# Altium schematic sheet orbital-r1.SchDoc
size 400 x 299 mm; SheetNumber: 1; SheetTotal: 1
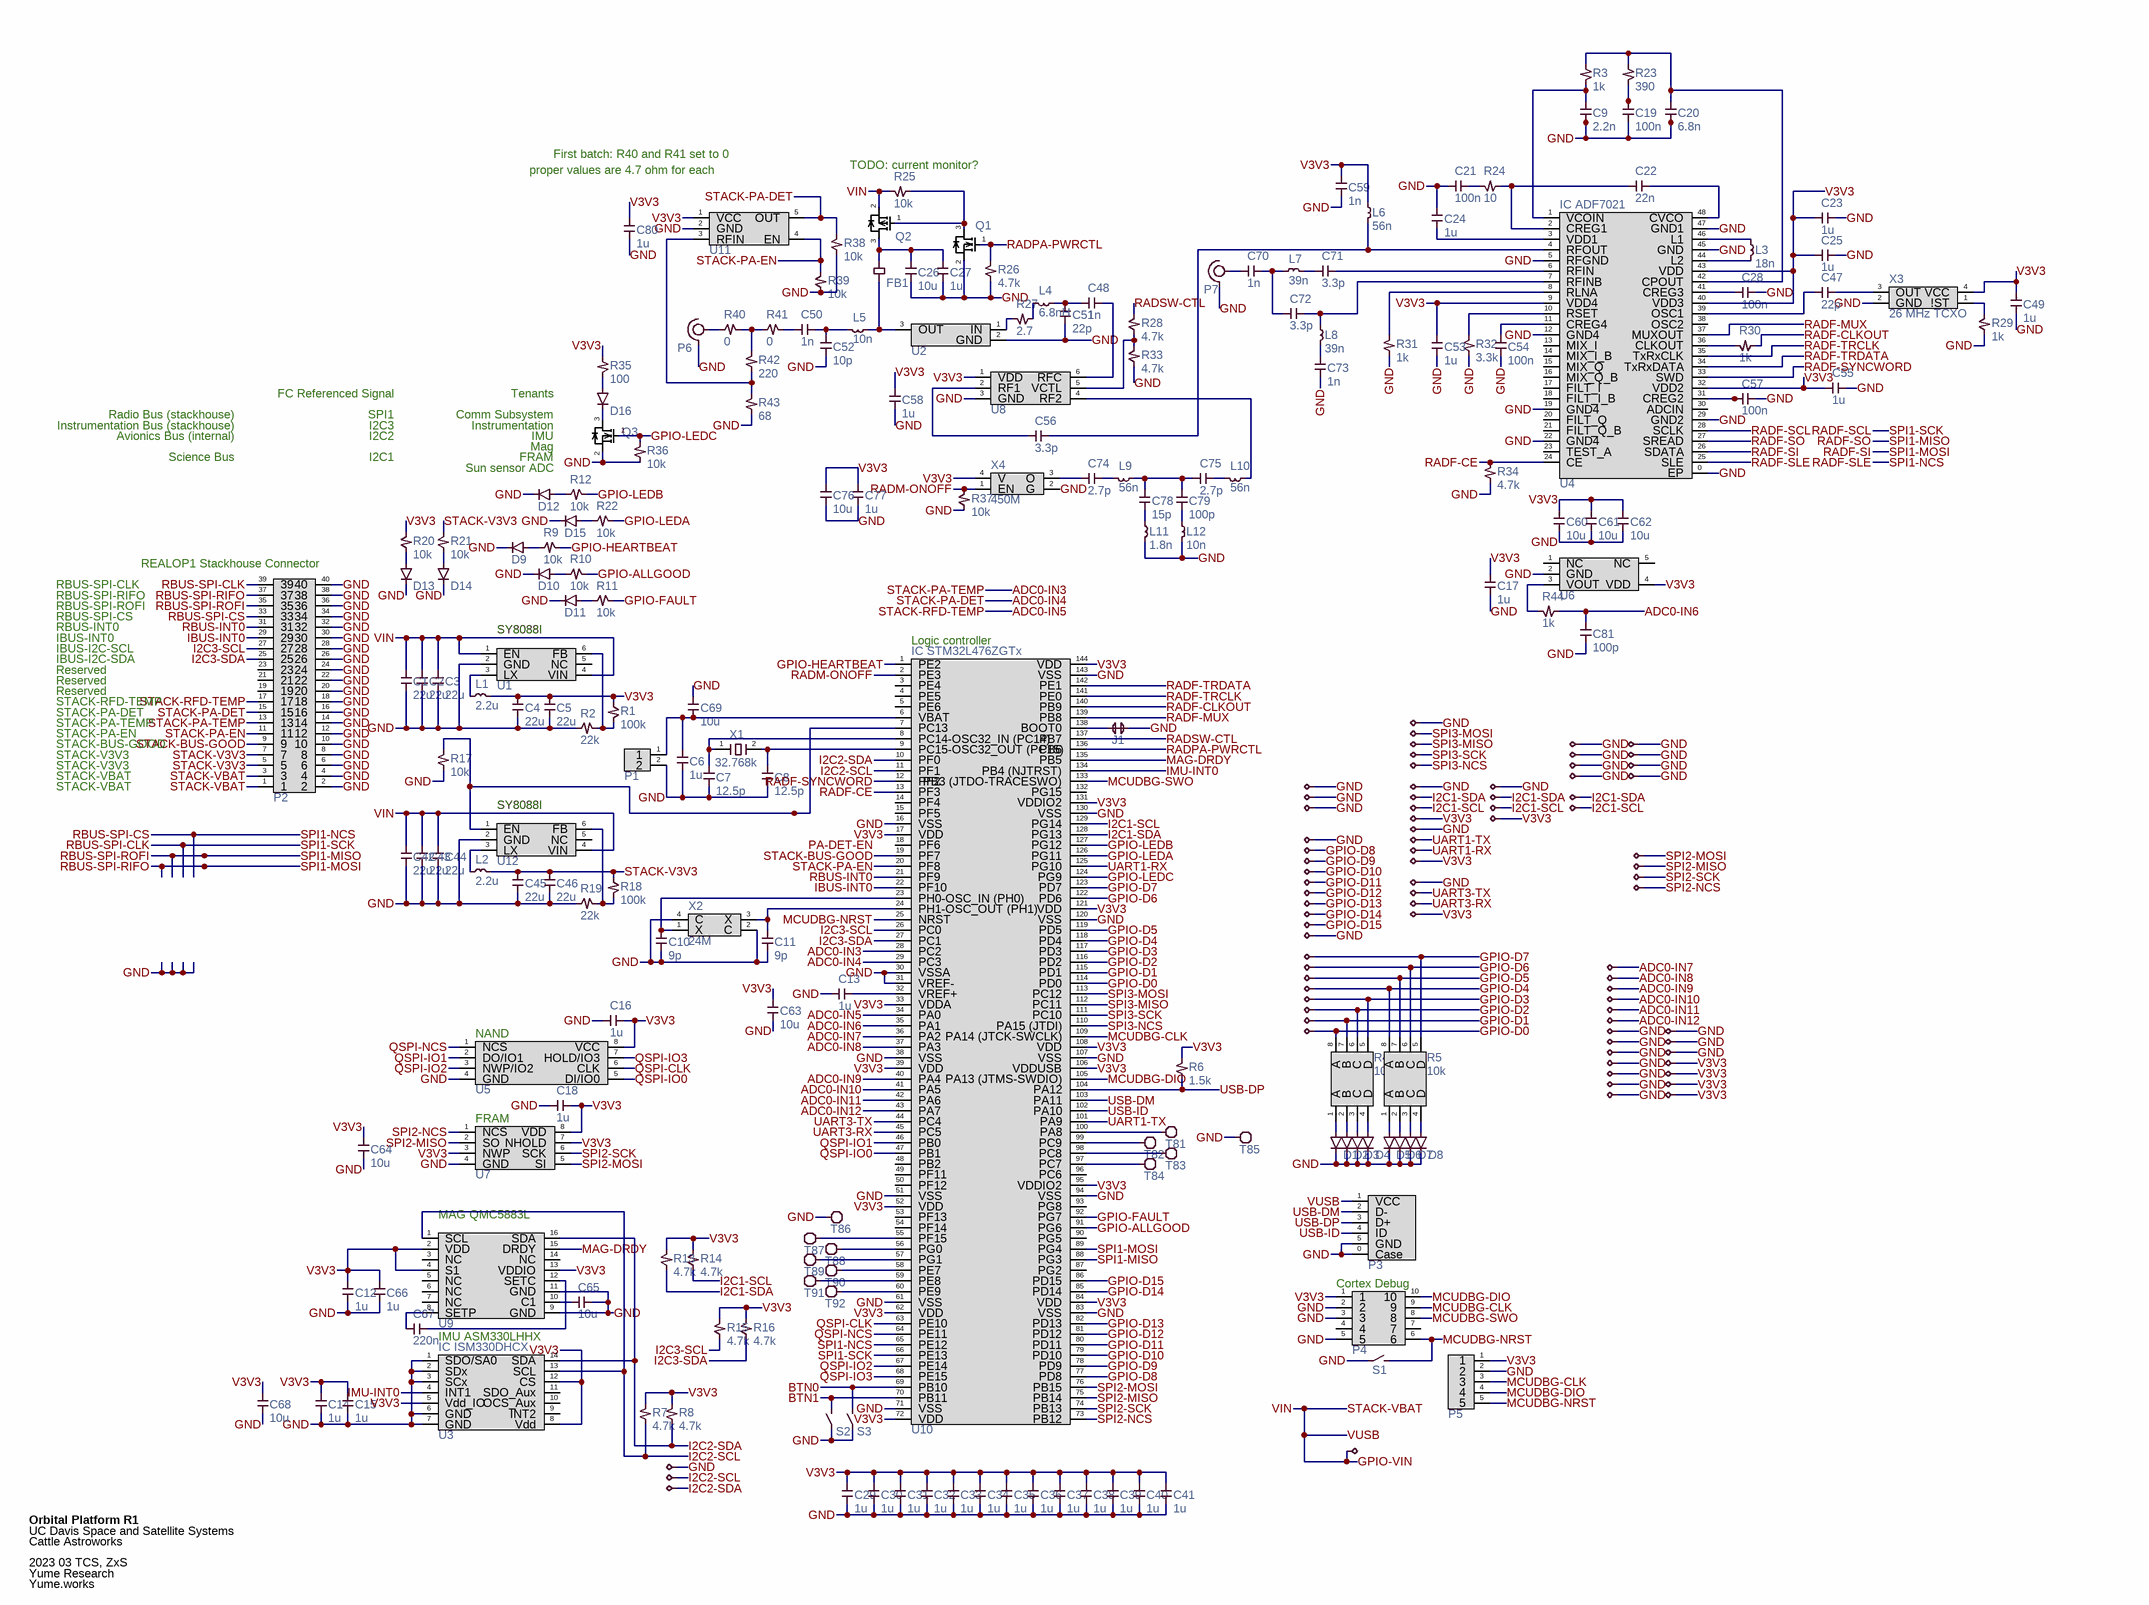
[diagram p0: orbital-r1.SchDoc]

## Parts
C1  22u  [C0805]
C2  22u  [C0805]
C3  22u  [C0805]
C4  22u  [C0805]
C5  22u  [C0805]
C6  1u  [C0402]
C7  12.5p  [C0402]
C8  12.5p  [C0402]
C9  2.2n  [C0402]
C10  9p  [C0402]
C11  9p  [C0402]
C12  1u  [C0402]
C13  1u  [C0402]
C14  1u  [C0402]
C15  1u  [C0402]
C16  1u  [C0402]
C17  1u  [C0402]
C18  1u  [C0402]
C19  100n  [C0402]
C20  6.8n  [C0402]
C21  100n  [C0402]
C22  22n  [C0402]
C23  1u  [C0402]
C24  1u  [C0402]
C25  1u  [C0402]
C26  10u  [C0603]
C27  1u  [C0402]
C28  100n  [C0402]
C29  1u  [C0402]
C30  1u  [C0402]
C31  1u  [C0402]
C32  1u  [C0402]
C33  1u  [C0402]
C34  1u  [C0402]
C35  1u  [C0402]
C36  1u  [C0402]
C37  1u  [C0402]
C38  1u  [C0402]
C39  1u  [C0402]
C40  1u  [C0402]
C41  1u  [C0402]
C42  22u  [C0805]
C43  22u  [C0805]
C44  22u  [C0805]
C45  22u  [C0805]
C46  22u  [C0805]
C47  22p  [C0402]
C48  1n  [C0402]
C49  1u  [C0402]
C50  1n  [C0402]
C51  22p  [C0402]
C52  10p  [C0402]
C53  1u  [C0402]
C54  100n  [C0402]
C55  1u  [C0402]
C56  3.3p  [C0402]
C57  100n  [C0402]
C58  1u  [C0402]
C59  1n  [C0402]
C60  10u  [C0603]
C61  10u  [C0603]
C62  10u  [C0603]
C63  10u  [C0603]
C64  10u  [C0603]
C65  10u  [C0603]
C66  1u  [C0402]
C67  220n  [C0402]
C68  10u  [C0603]
C69  10u  [C0603]
C70  1n  [C0402]
C71  3.3p  [C0402]
C72  3.3p  [C0402]
C73  1n  [C0402]
C74  2.7p  [C0402]
C75  2.7p  [C0402]
C76  10u  [C0603]
C77  1u  [C0402]
C78  15p  [C0402]
C79  100p  [C0402]
C80  1u  [C0402]
C81  100p  [C0402]
D1  LED White  [LED0603v2]  (value not drawn)
D2  LED White  [LED0603v2]  (value not drawn)
D3  LED White  [LED0603v2]  (value not drawn)
D4  LED White  [LED0603v2]  (value not drawn)
D5  LED White  [LED0603v2]  (value not drawn)
D6  LED White  [LED0603v2]  (value not drawn)
D7  LED White  [LED0603v2]  (value not drawn)
D8  LED White  [LED0603v2]  (value not drawn)
D9  LED Yellow  [LED0603v2]  (value not drawn)
D10  LED Green  [LED0603v2]  (value not drawn)
D11  LED Red  [LED0603v2]  (value not drawn)
D12  LED Blue  [LED0603v2]  (value not drawn)
D13  LED Yellow  [LED0603v2]  (value not drawn)
D14  LED Yellow  [LED0603v2]  (value not drawn)
D15  LED Blue  [LED0603v2]  (value not drawn)
D16  D VLMx333  [PLCC2]  (value not drawn)
FB1  FB0603  [C0603]  (value not drawn)
J1  J-16M  [J16M]  (value not drawn)  (net tie, no BOM)
L1  2.2u  [C1008]
L2  2.2u  [C1008]
L3  18n  [C0402]
L4  6.8nH  [C0402]
L5  10n  [C0402]
L6  56n  [C0402]
L7  39n  [C0402]
L8  39n  [C0402]
L9  56n  [C0402]
L10  56n  [C0402]
L11  1.8n  [C0402]
L12  10n  [C0402]
P1  H254-021-85  [H254-021-85]  (value not drawn)
P2  H254-202-85  [H254-202-85]  (value not drawn)
P3  P Micro USB B  [USB-Micro-B]  (value not drawn)
P4  H127-052-S  [H127-052-S]  (value not drawn)
P5  H254-051-85  [H254-051-85]  (value not drawn)
P6  P MMCX-EM  [MMCX-EM]  (value not drawn)
P7  P MMCX-EM  [MMCX-EM]  (value not drawn)
Q1  Q NCE3400  [SOT23-3]  (value not drawn)
Q2  Q Si2301  [SOT23-3]  (value not drawn)
Q3  Q NCE3400  [SOT23-3]  (value not drawn)
R1  100k  [C0402]
R2  22k  [C0402]
R3  1k  [C0402]
R4  10k  [R0603x4]
R5  10k  [R0603x4]
R6  1.5k  [C0402]
R7  4.7k  [C0402]
R8  4.7k  [C0402]
R9  10k  [C0402]
R10  10k  [C0402]
R11  10k  [C0402]
R12  10k  [C0402]
R13  4.7k  [C0402]
R14  4.7k  [C0402]
R15  4.7k  [C0402]
R16  4.7k  [C0402]
R17  10k  [C0402]
R18  100k  [C0402]
R19  22k  [C0402]
R20  10k  [C0402]
R21  10k  [C0402]
R22  10k  [C0402]
R23  390  [C0402]
R24  10  [C0402]
R25  10k  [C0402]
R26  4.7k  [C0402]
R27  2.7  [C0402]
R28  4.7k  [C0402]
R29  1k  [C0402]
R30  1k  [C0402]
R31  1k  [C0402]
R32  3.3k  [C0402]
R33  4.7k  [C0402]
R34  4.7k  [C0402]
R35  100  [C0603]
R36  10k  [C0402]
R37  10k  [C0402]
R38  10k  [C0402]
R39  10k  [C0402]
R40  0  [C0402]
R41  0  [C0402]
R42  220  [C0402]
R43  68  [C0402]
R44  1k  [C0402]
S1  S BTN1185  [BTN1185]  (value not drawn)
S2  S BTN1185  [BTN1185]  (value not drawn)
S3  S BTN1185  [BTN1185]  (value not drawn)
T1  TP254-2  [H254-011-85]  (value not drawn)
T2  TP254-2  [H254-011-85]  (value not drawn)
T3  TP254-2  [H254-011-85]  (value not drawn)
T4  TP254-2  [H254-011-85]  (value not drawn)
T5  TP254-2  [H254-011-85]  (value not drawn)
T6  TP254-2  [H254-011-85]  (value not drawn)
T7  TP254-2  [H254-011-85]  (value not drawn)
T8  TP254-2  [H254-011-85]  (value not drawn)
T9  TP254-2  [H254-011-85]  (value not drawn)
T10  TP254-2  [H254-011-85]  (value not drawn)
T11  TP254-2  [H254-011-85]  (value not drawn)
T12  TP254-2  [H254-011-85]  (value not drawn)
T13  TP254-2  [H254-011-85]  (value not drawn)
T14  TP254-2  [H254-011-85]  (value not drawn)
T15  TP254-2  [H254-011-85]  (value not drawn)
T16  TP254-2  [H254-011-85]  (value not drawn)
T17  TP254-2  [H254-011-85]  (value not drawn)
T18  TP254-2  [H254-011-85]  (value not drawn)
T19  TP254-2  [H254-011-85]  (value not drawn)
T20  TP254-2  [H254-011-85]  (value not drawn)
T21  TP254-2  [H254-011-85]  (value not drawn)
T22  TP254-2  [H254-011-85]  (value not drawn)
T23  TP254-2  [H254-011-85]  (value not drawn)
T24  TP254-2  [H254-011-85]  (value not drawn)
T25  TP254-2  [H254-011-85]  (value not drawn)
T26  TP254-2  [H254-011-85]  (value not drawn)
T27  TP254-2  [H254-011-85]  (value not drawn)
T28  TP254-2  [H254-011-85]  (value not drawn)
T29  TP254-2  [H254-011-85]  (value not drawn)
T30  TP254-2  [H254-011-85]  (value not drawn)
T31  TP254-2  [H254-011-85]  (value not drawn)
T32  TP254-2  [H254-011-85]  (value not drawn)
T33  TP254-2  [H254-011-85]  (value not drawn)
T34  TP254-2  [H254-011-85]  (value not drawn)
T35  TP254-2  [H254-011-85]  (value not drawn)
T36  TP254-2  [H254-011-85]  (value not drawn)
T37  TP254-2  [H254-011-85]  (value not drawn)
T38  TP254-2  [H254-011-85]  (value not drawn)
T39  TP254-2  [H254-011-85]  (value not drawn)
T40  TP254-2  [H254-011-85]  (value not drawn)
T41  TP254-2  [H254-011-85]  (value not drawn)
T42  TP254-2  [H254-011-85]  (value not drawn)
T43  TP254-2  [H254-011-85]  (value not drawn)
T44  TP254-2  [H254-011-85]  (value not drawn)
T45  TP254-2  [H254-011-85]  (value not drawn)
T46  TP254-2  [H254-011-85]  (value not drawn)
T47  TP254-2  [H254-011-85]  (value not drawn)
T48  TP254-2  [H254-011-85]  (value not drawn)
T49  TP254-2  [H254-011-85]  (value not drawn)
T50  TP254-2  [H254-011-85]  (value not drawn)
T51  TP254-2  [H254-011-85]  (value not drawn)
T52  TP254-2  [H254-011-85]  (value not drawn)
T53  TP254-2  [H254-011-85]  (value not drawn)
T54  TP254-2  [H254-011-85]  (value not drawn)
T55  TP254-2  [H254-011-85]  (value not drawn)
T56  TP254-2  [H254-011-85]  (value not drawn)
T57  TP254-2  [H254-011-85]  (value not drawn)
T58  TP254-2  [H254-011-85]  (value not drawn)
T59  TP254-2  [H254-011-85]  (value not drawn)
T60  TP254-2  [H254-011-85]  (value not drawn)
T61  TP254-2  [H254-011-85]  (value not drawn)
T62  TP254-2  [H254-011-85]  (value not drawn)
T63  TP254-2  [H254-011-85]  (value not drawn)
T64  TP254-2  [H254-011-85]  (value not drawn)
T65  TP254-2  [H254-011-85]  (value not drawn)
T66  TP254-2  [H254-011-85]  (value not drawn)
T67  TP254-2  [H254-011-85]  (value not drawn)
T68  TP254-2  [H254-011-85]  (value not drawn)
T69  TP254-2  [H254-011-85]  (value not drawn)
T70  TP254-2  [H254-011-85]  (value not drawn)
T71  TP254-2  [H254-011-85]  (value not drawn)
T72  TP254-2  [H254-011-85]  (value not drawn)
T73  TP254-2  [H254-011-85]  (value not drawn)
T74  TP254-2  [H254-011-85]  (value not drawn)
T75  TP254-2  [H254-011-85]  (value not drawn)
T76  TP254-2  [H254-011-85]  (value not drawn)
T77  TP254-2  [H254-011-85]  (value not drawn)
T78  TP254-2  [H254-011-85]  (value not drawn)
T79  TP254-2  [H254-011-85]  (value not drawn)
T80  TP254-2  [H254-011-85]  (value not drawn)
T81  TP2510  [TP2510]  (value not drawn)  (no BOM)
T82  TP2510  [TP2510]  (value not drawn)  (no BOM)
T83  TP2510  [TP2510]  (value not drawn)  (no BOM)
T84  TP2510  [TP2510]  (value not drawn)  (no BOM)
T85  TP2510  [TP2510]  (value not drawn)  (no BOM)
T86  TP2510  [TP2510]  (value not drawn)  (no BOM)
T87  TP2510  [TP2510]  (value not drawn)  (no BOM)
T88  TP2510  [TP2510]  (value not drawn)  (no BOM)
T89  TP2510  [TP2510]  (value not drawn)  (no BOM)
T90  TP2510  [TP2510]  (value not drawn)  (no BOM)
T91  TP2510  [TP2510]  (value not drawn)  (no BOM)
T92  TP2510  [TP2510]  (value not drawn)  (no BOM)
U1  IC AP3419  [SOT23-6]  (value not drawn)
U2  IC TQP7M9102  [SOT89-3]  (value not drawn)
U3  IC ISM330DHCX  [LGA14-5]
U4  IC ADF7021  [QFN48-7-0.5-4.1]
U5  IC W25Q128JVSIQ  [SOIC8]  (value not drawn)
U6  IC TMP235  [SOT363-5]  (value not drawn)
U7  IC MB85RS256B  [SOP8]  (value not drawn)
U8  IC SKY13453  [QFN6]  (value not drawn)
U9  IC QMC5883L  [LGA16-5]  (value not drawn)
U10  IC STM32L476ZGTx  [QFP144-20-0.5]
U11  IC MAX2204  [SOT23-5]  (value not drawn)
U12  IC AP3419  [SOT23-6]  (value not drawn)
X1  32.768k  [XO3215-2P]
X2  24M  [XO3225]
X3  26 MHz TCXO  [XO2520M1]
X4  450M  [XO3225]

## Nets
ADC0-IN3: P2.13 U10.28(PC2)  [also labelled STACK-PA-TEMP]
ADC0-IN4: P2.15 R38.1 U10.29(PC3) U11.5(OUT)  [also labelled STACK-PA-DET]
ADC0-IN5: P2.17 U10.34(PA0)  [also labelled STACK-RFD-TEMP]
ADC0-IN6: C81.1 R44.2 U10.35(PA1)
ADC0-IN7: T63.1 U10.36(PA2)
ADC0-IN8: T64.1 U10.37(PA3)
ADC0-IN9: T65.1 U10.40(PA4)
ADC0-IN10: T66.1 U10.41(PA5)
ADC0-IN11: T67.1 U10.42(PA6)
ADC0-IN12: T68.1 U10.43(PA7)
BTN0: S3.2 U10.69(PB10)
BTN1: S2.2 U10.70(PB11)
GND: C1.1 C2.1 C3.1 C4.1 C5.1 C6.1 C7.1 C8.1 C9.2 C10.1 C11.1 C12.1 C13.2 C14.1 C15.1 C16.2 C17.1 C18.2 C19.2 C20.2 C21.2 C23.1 C24.2 C25.1 C26.1 C27.1 C28.1 C29.1 C30.1 C31.1 C32.1 C33.1 C34.1 C35.1 C36.1 C37.1 C38.1 C39.1 C40.1 C41.1 C42.1 C43.1 C44.1 C45.1 C46.1 C49.1 C51.2 C52.2 C53.1 C54.1 C55.1 C57.1 C58.1 C59.2 C60.1 C61.1 C62.1 C63.1 C64.1 C65.2 C66.1 C68.1 C69.1 C73.1 C76.1 C77.1 C80.1 C81.2 D1.1 D2.1 D3.1 D4.1 D5.1 D6.1 D7.1 D8.1 D9.1 D10.1 D11.1 D12.1 D13.1 D14.1 D15.1 J1.2 L11.1 L12.1 P1.2 P2.2 P2.4 P2.6 P2.8 P2.10 P2.12 P2.14 P2.16 P2.18 P2.20 P2.22 P2.24 P2.26 P2.28 P2.30 P2.32 P2.34 P2.36 P2.38 P2.40 P3.0(Case) P3.5(GND) P4.2 P4.3 P4.5 P5.2 P6.0 P7.0 Q1.2 Q3.2 R2.2 R17.2 R19.2 R26.2 R29.2 R31.2 R32.2 R33.2 R34.2 R36.2 R37.2 R38.2 R39.2 R43.2 S1.1 S2.1 S3.1 T1.1 T6.1 T7.1 T11.1 T12.1 T20.1 T28.1 T29.1 T38.1 T43.1 T44.1 T45.1 T46.1 T47.1 T50.1 T51.1 T52.1 T53.1 T54.1 T55.1 T56.1 T69.1 T70.1 T71.1 T72.1 T73.1 T75.1 T77.1 T79.1 T85.1 T86.1 U1.2(GND) U2.2(GND) U3.1(SDO/SA0) U3.2(SDx) U3.3(SCx) U3.6(GND) U3.7(GND) U4.0(EP) U4.5(RFGND) U4.12(GND4) U4.19(GND4) U4.22(GND4) U4.29(GND2) U4.45(GND) U4.47(GND1) U5.4(GND) U6.2(GND) U7.4(GND) U8.3(GND) U9.9(GND) U9.11(GND) U10.16(VSS) U10.30(VSSA) U10.31(VREF-) U10.38(VSS) U10.51(VSS) U10.61(VSS) U10.71(VSS) U10.83(VSS) U10.94(VSS) U10.107(VSS) U10.120(VSS) U10.130(VSS) U10.143(VSS) U11.2(GND) U12.2(GND) X2.2(C) X2.4(C) X3.2(GND) X4.2(G)
GPIO-ALLGOOD: R10.1 U10.91(PG6)
GPIO-D0: R4.8(A) T37.1 U10.114(PD0)
GPIO-D1: R4.7(B) T36.1 U10.115(PD1)
GPIO-D2: R4.6(C) T35.1 U10.116(PD2)
GPIO-D3: R4.5(D) T34.1 U10.117(PD3)
GPIO-D4: R5.8(A) T33.1 U10.118(PD4)
GPIO-D5: R5.7(B) T32.1 U10.119(PD5)
GPIO-D6: R5.6(C) T31.1 U10.122(PD6)
GPIO-D7: R5.5(D) T30.1 U10.123(PD7)
GPIO-D8: T14.1 U10.77(PD8)
GPIO-D9: T16.1 U10.78(PD9)
GPIO-D10: T18.1 U10.79(PD10)
GPIO-D11: T19.1 U10.80(PD11)
GPIO-D12: T21.1 U10.81(PD12)
GPIO-D13: T23.1 U10.82(PD13)
GPIO-D14: T25.1 U10.85(PD14)
GPIO-D15: T27.1 U10.86(PD15)
GPIO-FAULT: R11.1 U10.92(PG7)
GPIO-HEARTBEAT: R9.1 U10.1(PE2)
GPIO-LEDA: R22.1 U10.126(PG11)
GPIO-LEDB: R12.1 U10.127(PG12)
GPIO-LEDC: Q3.1 R36.1 U10.124(PG9)
GPIO-VIN: C1.2 C2.2 C3.2 C42.2 C43.2 C44.2 P2.1 P2.3 P3.1(VCC) Q2.2 R25.1 T42.1 U1.1(EN) U1.4(VIN) U12.4(VIN)  [also labelled STACK-VBAT, VIN, VUSB]
I2C1-SCL: R14.2 T9.1 T49.1 T60.1 U10.129(PG14)
I2C1-SDA: R13.2 T8.1 T48.1 T59.1 U10.128(PG13)
I2C2-SCL: R7.2 T39.1 U3.13(SCL) U9.1(SCL) U10.11(PF1)
I2C2-SDA: R8.2 T40.1 U3.14(SDA) U9.16(SDA) U10.10(PF0)
I2C3-SCL: P2.27 R15.2 U10.26(PC0)
I2C3-SDA: P2.25 R16.2 U10.27(PC1)
IBUS-INT0: P2.29 U10.22(PF10)
IMU-INT0: U3.4(INT1) U10.134(PB4_(NJTRST))
MAG-DRDY: U9.15(DRDY) U10.135(PB5)
MCUDBG-CLK: P4.9 P5.3 U10.109(PA14_(JTCK-SWCLK))
MCUDBG-DIO: P4.10 P5.4 U10.105(PA13_(JTMS-SWDIO))
MCUDBG-NRST: P4.6 P5.5 S1.2 U10.25(NRST)
MCUDBG-SWO: P4.8 U10.133(PB3_(JTDO-TRACESWO))
QSPI-CLK: U5.6(CLK) U10.63(PE10)
QSPI-IO0: U5.5(DI/IO0) U10.47(PB1)
QSPI-IO1: U5.2(DO/IO1) U10.46(PB0)
QSPI-IO2: U5.3(NWP/IO2) U10.67(PE14)
QSPI-IO3: U5.7(HOLD/IO3) U10.68(PE15)
QSPI-NCS: U5.1(NCS) U10.64(PE11)
RADF-CE: R34.1 U4.24(CE) U10.13(PF3)
RADF-CLKOUT: R30.2 U10.140(PB9)
RADF-MUX: U4.37(MUXOUT) U10.139(PB8)
RADF-SCL: P2.39 U4.28(SCLK) U10.66(PE13)  [also labelled RBUS-SPI-CLK, SPI1-SCK]
RADF-SI: P2.37 U4.26(SDATA) U10.89(PG4)  [also labelled RBUS-SPI-RIFO, SPI1-MOSI]
RADF-SLE: P2.33 U4.25(SLE) U10.65(PE12)  [also labelled RBUS-SPI-CS, SPI1-NCS]
RADF-SO: P2.35 U4.27(SREAD) U10.88(PG3)  [also labelled RBUS-SPI-ROFI, SPI1-MISO]
RADF-SYNCWORD: U4.33(SWD) U10.12(PF2)
RADF-TRCLK: U4.35(TxRxCLK) U10.141(PE0)
RADF-TRDATA: U4.34(TxRxDATA) U10.142(PE1)
RADM-ONOFF: R37.1 U10.2(PE3) X4.1(EN)
RADPA-PWRCTL: Q1.1 R26.1 U10.136(PB6)
RADSW-CTL: R28.1 U10.137(PB7)
RBUS-INT0: P2.31 U10.21(PF9)
SPI2-MISO: T57.1 U7.2(SO) U10.75(PB14)
SPI2-MOSI: T41.1 U7.5(SI) U10.76(PB15)
SPI2-NCS: T62.1 U7.1(NCS) U10.73(PB12)
SPI2-SCK: T58.1 U7.6(SCK) U10.74(PB13)
SPI3-MISO: T3.1 U10.112(PC11)
SPI3-MOSI: T2.1 U10.113(PC12)
SPI3-NCS: T5.1 U10.110(PA15_(JTDI))
SPI3-SCK: T4.1 U10.111(PC10)
STACK-BUS-GOOD: P2.9 U10.19(PF7)
STACK-PA-EN: P2.11 R39.1 U10.20(PF8) U11.4(EN)
STACK-V3V3: C45.2 C46.2 L2.1 P2.5 P2.7 R18.2 R21.1
UART1-RX: T15.1 U10.125(PG10)
UART1-TX: T13.1 U10.101(PA9)
UART3-RX: T24.1 U10.45(PC5)
UART3-TX: T22.1 U10.44(PC4)
USB-DM: P3.2(D-) U10.103(PA11)
USB-DP: P3.3(D+) R6.2 U10.104(PA12)
USB-ID: P3.4(ID) U10.102(PA10)
V3V3: C4.2 C5.2 C12.2 C14.2 C15.2 C16.1 C17.2 C18.1 C23.2 C25.2 C29.2 C30.2 C31.2 C32.2 C33.2 C34.2 C35.2 C36.2 C37.2 C38.2 C39.2 C40.2 C41.2 C49.2 C53.2 C55.2 C58.2 C59.1 C60.2 C61.2 C62.2 C63.2 C64.2 C66.2 C68.2 C76.2 C77.2 C80.2 L1.1 L6.2 P4.1 P5.1 R1.2 R6.1 R7.1 R8.1 R13.1 R14.1 R15.1 R16.1 R20.1 R35.2 T10.1 T17.1 T26.1 T61.1 T74.1 T76.1 T78.1 T80.1 U3.5(Vdd_IO) U3.8(Vdd) U3.12(CS) U4.9(VDD4) U4.32(VDD2) U4.40(VDD3) U4.43(VDD) U5.8(VCC) U6.4(VDD) U7.3(NWP) U7.7(NHOLD) U7.8(VDD) U8.1(VDD) U9.2(VDD) U9.4(S1) U9.13(VDDIO) U10.17(VDD) U10.33(VDDA) U10.39(VDD) U10.52(VDD) U10.62(VDD) U10.72(VDD) U10.84(VDD) U10.95(VDDIO2) U10.106(VDDUSB) U10.108(VDD) U10.121(VDD) U10.131(VDDIO2) U10.144(VDD) U11.1(VCC) X3.4(VCC) X4.4(V)
NetC6_2: C6.2 C69.2 P1.1 U10.6(VBAT)
NetC7_2: C7.2 U10.8(PC14-OSC32_IN_(PC14)) X1.1
NetC8_2: C8.2 U10.9(PC15-OSC32_OUT_(PC15)) X1.2
NetC9_1: C9.1 R3.1 U4.1(VCOIN)
NetC10_2: C10.2 U10.23(PH0-OSC_IN_(PH0)) X2.1(X)
NetC11_2: C11.2 U10.24(PH1-OSC_OUT_(PH1)) X2.3(X)
NetC13_1: C13.1 U10.32(VREF+)
NetC19_1: C19.1 R23.1
NetC20_1: C20.1 R3.2 R23.2 U4.42(CPOUT)
NetC21_1: C21.1 R24.1
NetC22_1: C22.1 U4.48(CVCO)
NetC22_2: C22.2 R24.2 U4.2(CREG1)
NetC24_1: C24.1 U4.3(VDD1)
NetC26_2: C26.2 C27.2 FB1.2 Q2.3
NetC28_2: C28.2 U4.41(CREG3)
NetC47_1: C47.1 U4.39(OSC1)
NetC47_2: C47.2 X3.3(OUT)
NetC48_1: C48.1 U8.6(RFC)
NetC48_2: C48.2 C51.1 L4.2
NetC50_1: C50.1 C52.1 L5.1
NetC50_2: C50.2 R41.1
NetC54_2: C54.2 U4.11(CREG4)
NetC56_1: C56.1 L6.1 U4.4(RFOUT)
NetC56_2: C56.2 U8.2(RF1)
NetC57_2: C57.2 U4.31(CREG2)
NetC65_1: C65.1 U9.10(C1)
NetC67_1: C67.1 U9.12(SETC)
NetC67_2: C67.2 U9.8(SETP)
NetC70_1: C70.1 P7.1
NetC70_2: C70.2 C72.1 L7.2
NetC71_1: C71.1 L7.1
NetC71_2: C71.2 U4.6(RFIN)
NetC72_2: C72.2 L8.2 U4.7(RFINB)
NetC73_2: C73.2 L8.1
NetC74_1: C74.1 L9.1
NetC74_2: C74.2 X4.3(O)
NetC75_1: C75.1 L10.1
NetC75_2: C75.2 C78.1 C79.1 L9.2
NetC78_2: C78.2 L11.2
NetC79_2: C79.2 L12.2
NetD1_2: D1.2 R4.1(A)
NetD2_2: D2.2 R4.2(B)
NetD3_2: D3.2 R4.3(C)
NetD4_2: D4.2 R4.4(D)
NetD5_2: D5.2 R5.1(A)
NetD6_2: D6.2 R5.2(B)
NetD7_2: D7.2 R5.3(C)
NetD8_2: D8.2 R5.4(D)
NetD9_2: D9.2 R9.2
NetD10_2: D10.2 R10.2
NetD11_2: D11.2 R11.2
NetD12_2: D12.2 R12.2
NetD13_2: D13.2 R20.2
NetD14_2: D14.2 R21.2
NetD15_2: D15.2 R22.2
NetD16_1: D16.1 Q3.3
NetD16_2: D16.2 R35.1
NetFB1_1: FB1.1 L5.2 U2.3(OUT)
NetJ1_1: J1.1 U10.138(BOOT0)
NetL1_2: L1.2 U1.3(LX)
NetL2_2: L2.2 U12.3(LX)
NetL3_1: L3.1 U4.44(L2)
NetL3_2: L3.2 U4.46(L1)
NetL4_1: L4.1 R27.2
NetL10_2: L10.2 U8.4(RF2)
NetP6_1: P6.1 R40.2
NetQ1_3: Q1.3 Q2.1 R25.2
NetR1_1: R1.1 R2.1 U1.6(FB)
NetR17_1: R17.1 U10.7(PC13) U12.1(EN)
NetR18_1: R18.1 R19.1 U12.6(FB)
NetR27_1: R27.1 U2.1(IN)
NetR28_2: R28.2 R33.1 U8.5(VCTL)
NetR29_1: R29.1 X3.1(!ST)
NetR30_1: R30.1 U4.36(CLKOUT)
NetR31_1: R31.1 U4.8(RLNA)
NetR32_1: R32.1 U4.10(RSET)
NetR40_1: R40.1 R41.2 R42.1
NetR42_2: R42.2 R43.1 U11.3(RFIN)
NetR44_1: R44.1 U6.3(VOUT)
NetT81_1: T81.1 U10.100(PA8)
NetT82_1: T82.1 U10.99(PC9)
NetT83_1: T83.1 U10.98(PC8)
NetT84_1: T84.1 U10.97(PC7)
NetT87_1: T87.1 U10.55(PF15)
NetT88_1: T88.1 U10.56(PG0)
NetT89_1: T89.1 U10.57(PG1)
NetT90_1: T90.1 U10.58(PE7)
NetT91_1: T91.1 U10.59(PE8)
NetT92_1: T92.1 U10.60(PE9)

Not connected (* = marked no-connect by the designer): P2 19 21 23; P4 4 7; U1 5(NC); U3 9(INT2) 10(OCS_Aux) 11(SDO_Aux); U4 13(MIX_I) 14(MIX_I_B) 15(MIX_Q) 16(MIX_Q_B) 17(FILT_I) 18(FILT_I_B) 20(FILT_Q) 21(FILT_Q_B) 23(TEST_A) 30(ADCIN) 38(OSC2); U6 1(NC) 5(NC); U9 3(NC) 5(NC) 6(NC) 7(NC) 14(NC); U10 3(PE4) 4(PE5) 5(PE6) 14(PF4) 15(PF5) 18(PF6) 48(PB2) 49(PF11) 50(PF12) 53(PF13) 54(PF14) 87(PG2) 90(PG5) 93(PG8) 96(PC6) 132(PG15); U12 5(NC)

## Notes on the sheet
- proper values are 4.7 ohm for each
- First batch: R40 and R41 set to 0
- (near R25) TODO: current monitor?
- Radio Bus (stackhouse)
- FC Referenced Signal
- SPI1
- Tenants
- Comm Subsystem
- Instrumentation Bus (stackhouse)
- Avionics Bus (internal)
- Science Bus
- I2C3
- I2C2
- I2C1
- Instrumentation
- IMU
- FRAM
- Sun sensor ADC
- Mag
- RBUS-SPI-CS
- RBUS-SPI-ROFI
- RBUS-SPI-RIFO
- RBUS-SPI-CLK
- (near P2) REALOP1 Stackhouse Connector
- Reserved
- IBUS-I2C-SDA
- IBUS-I2C-SCL
- IBUS-INT0
- RBUS-INT0
- (near U1) SY8088I
- (near U10) Logic controller
- STACK-V3V3
- STACK-BUS-GOOD
- STACK-PA-EN
- STACK-PA-TEMP
- STACK-PA-DET
- STACK-RFD-TEMP
- STACK-VBAT
- (near U12) SY8088I
- (near U5) NAND
- (near U7) FRAM
- (near U9) MAG QMC5883L
- (near P4) Cortex Debug
- IMU ASM330LHHX
- 2023 03 TCS, ZxS
- Orbital Platform R1
- UC Davis Space and Satellite Systems
- Cattle Astroworks
- Yume.works
- Yume Research
- Labels drawn without touching a wire or pin: PA-DET-EN

## Library data of the parts
C1-C5 C42-C46 = C0805
C6-C25 C27-C41 C47-C59 C66 C67 C70-C75 C77-C81 = C0402
C26 C60-C65 C68 C69 C76 = C0603
D1-D15 = D 0603: LED 0603
D16 = D VLMx333: Vishay power LED orange
L1 L2 = L 1008: 1008 [2520 metric] SMD inductor
L3-L12 = L 0402: 0402 [? metric] SMD inductor
P2 = H254-202-85: PC/104 style stack connector for REALOP1
P6 P7 = P MMCX-EM: RF MMCX connector
Q1 Q3 = Q NCE3400: N-Ch En MOSFET
Q2 = Q Si2301: P-Ch En MOSFET
R1-R3 R6-R34 R36-R44 = R0402
R4 R5 = R0603X4: Resistor array 0603 x4
R35 = R0603
U1 U12 = IC AP3419: Step down converter with synchronous rectification, 5V input
U2 = IC TQP7M9102: RF PA 0.5 W
U3 = IC ISM330DHCX: Fancy accelerometer and gyroscope
U4 = IC ADF7021: Sub GHz transceiver
U5 = IC W25Q128JVSIQ: nand flash 128 Mb (16 MB) winbond
U6 = IC TMP235: Analog output temperature sensor
U7 = IC MB85RS256B: FRAM, serial, 256 Mbit
U8 = IC SKY13453: Switch, RF, single control, 0.01 to 6 GHz
U9 = IC QMC5883L: Magnetometer
U10 = IC STM32L476ZGTx: Cortex-M4 MCU
U11 = IC MAX2204: RF Power detector
X1 = XO Generic 2P: Crystal oscillator
X2 = XO Resonator Generic: Crystal oscillator
X3 = XO Seiko SG210-STF: Crystal oscillator
X4 = XO Generic: Crystal oscillator